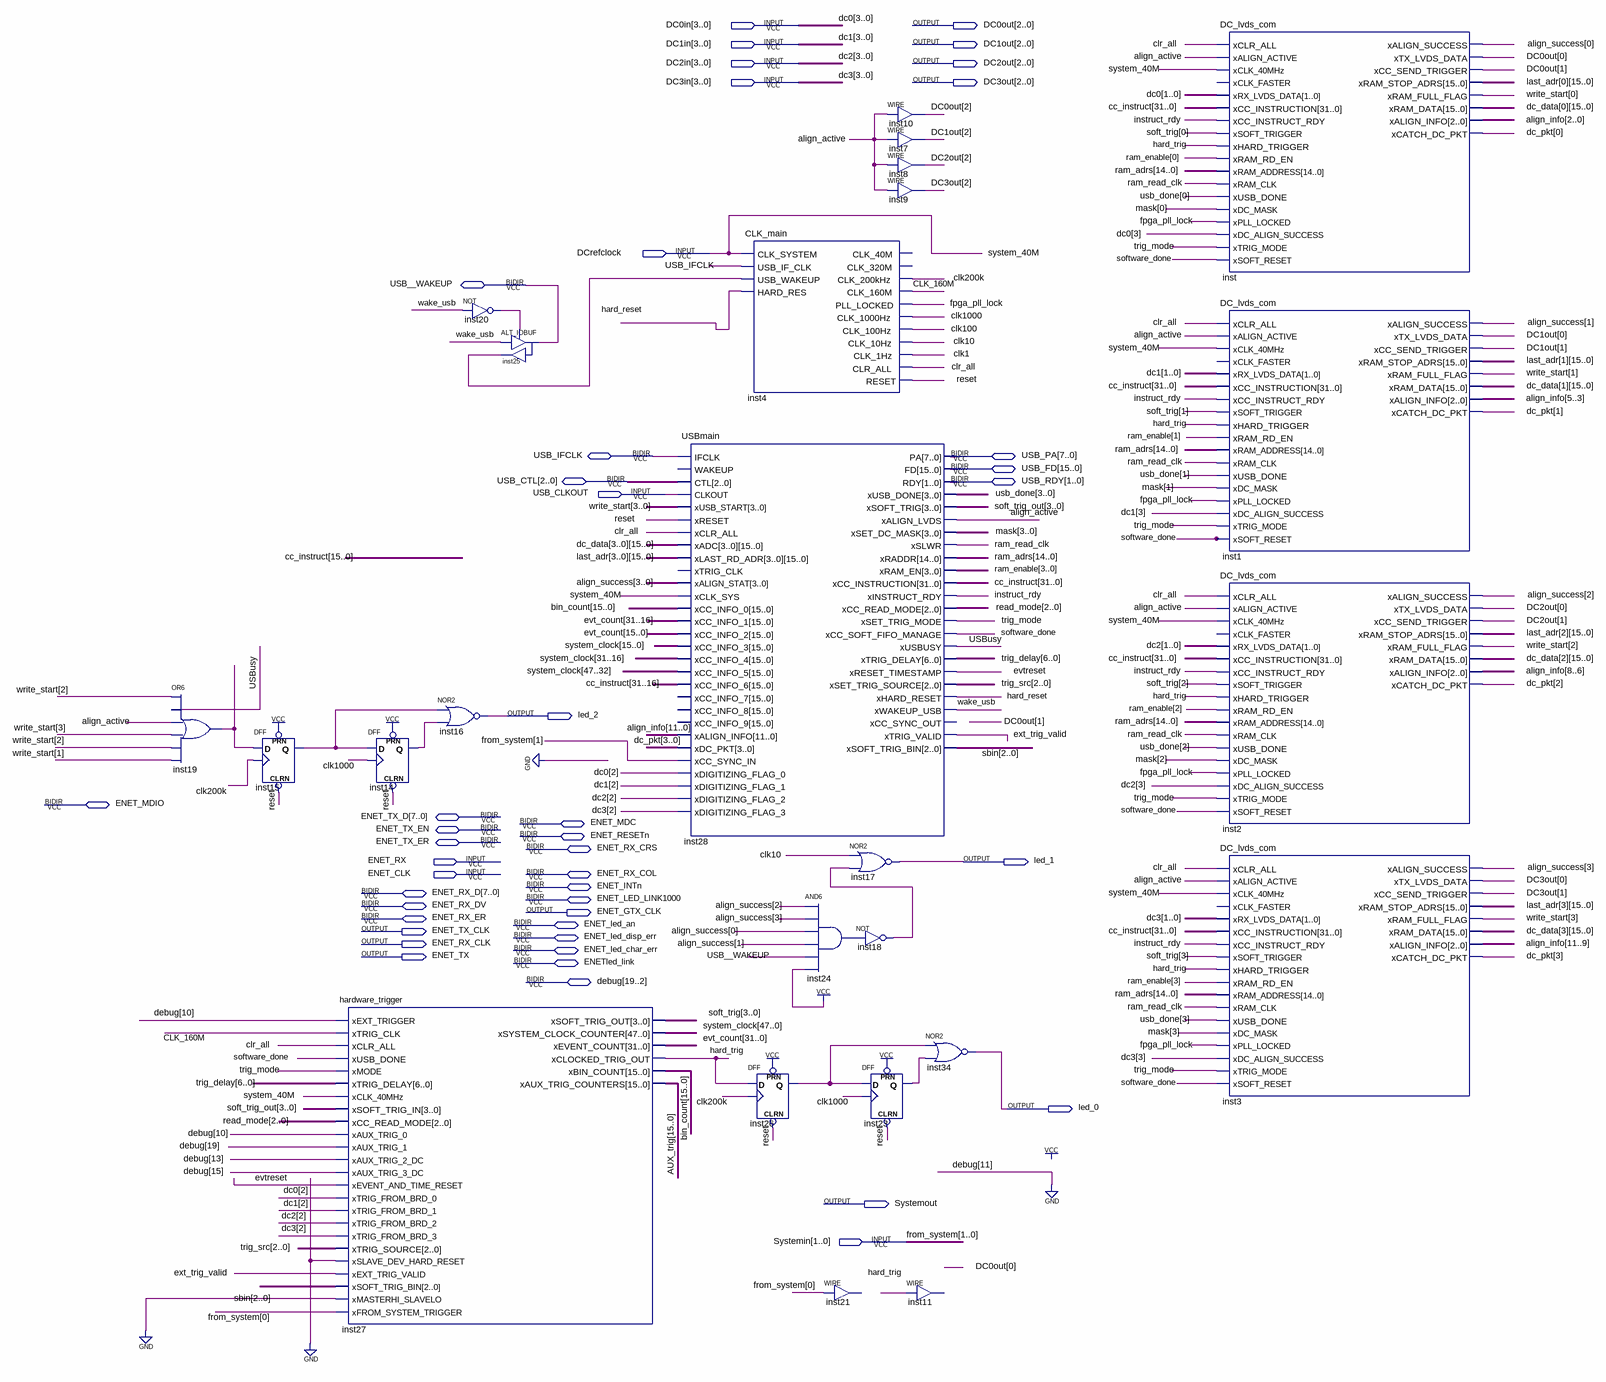
[diagram p0: schematic sheet]
// Quartus schematic Central_Card_Slave.bdf as structural Verilog: 25 symbols, 45 pins
module Central_Card_Slave (
  input  [3:0] DC0in,
  input  [3:0] DC1in,
  input  [3:0] DC2in,
  input  [3:0] DC3in,
  input  DCrefclock,
  input  USB_CLKOUT,
  input  ENET_RX,
  input  ENET_CLK,
  input  [1:0] Systemin,
  inout  USB__WAKEUP,
  inout  USB_IFCLK,
  inout  [7:0] USB_PA,
  inout  [15:0] USB_FD,
  inout  [2:0] USB_CTL,
  inout  [1:0] USB_RDY,
  inout  ENET_MDIO,
  inout  [7:0] ENET_TX_D,
  inout  ENET_MDC,
  inout  ENET_TX_EN,
  inout  ENET_RESETn,
  inout  ENET_TX_ER,
  inout  ENET_RX_CRS,
  inout  ENET_RX_COL,
  inout  ENET_INTn,
  inout  [7:0] ENET_RX_D,
  inout  ENET_LED_LINK1000,
  inout  ENET_RX_DV,
  inout  ENET_RX_ER,
  inout  ENET_led_an,
  inout  ENET_led_disp_err,
  inout  ENET_led_char_err,
  inout  ENETled_link,
  inout  [19:2] debug,
  output [2:0] DC0out,
  output [2:0] DC1out,
  output [2:0] DC2out,
  output [2:0] DC3out,
  output led_2,
  output led_1,
  output ENET_GTX_CLK,
  output ENET_TX_CLK,
  output ENET_RX_CLK,
  output ENET_TX,
  output led_0,
  output Systemout
);

  wire align_active, clk1, clk10, clk100, clk200k, clk1000, CLK_160M, clr_all, evtreset, ext_trig_valid,
       fpga_pll_lock, hard_reset, hard_trig, inst14_q, inst15_q, inst18_out, inst19_out, inst20_out,
       inst23_q, inst24_out, inst25_o, inst26_q, instruct_rdy, ram_read_clk, reset, software_done, trig_mode,
       USBusy, wake_usb;
  wire [2:0] read_mode, sbin, trig_src;
  wire [3:0] align_success, dc_pkt, mask, ram_enable, soft_trig, soft_trig_out, usb_done, write_start;
  wire [6:0] trig_delay;
  wire [11:0] align_info;
  wire [14:0] ram_adrs;
  wire [15:0] AUX_trig, bin_count, dc_data_0, dc_data_1, dc_data_2, dc_data_3, last_adr_0, last_adr_1,
       last_adr_2, last_adr_3;
  wire [31:0] cc_instruct, evt_count;
  wire [47:0] system_clock;

  or inst19 (inst19_out, write_start[2], USBusy, align_active, write_start[3], write_start[2], write_start[1]);
  DFF inst15 (.CLRN(reset), .CLK(clk200k), .D(inst19_out), .PRN(1'b1), .Q(inst15_q));
  hardware_trigger inst27 (
    .xEXT_TRIGGER(debug[10]), .xTRIG_CLK(CLK_160M), .xCLR_ALL(clr_all), .xUSB_DONE(software_done),
    .xMODE(trig_mode), .xTRIG_DELAY(trig_delay), .xCLK_40MHz(DCrefclock), .xSOFT_TRIG_IN(soft_trig_out),
    .xCC_READ_MODE(read_mode), .xAUX_TRIG_0(debug[10]), .xAUX_TRIG_1(debug[19]), .xAUX_TRIG_2_DC(debug[13]),
    .xAUX_TRIG_3_DC(debug[15]), .xEVENT_AND_TIME_RESET(evtreset), .xTRIG_FROM_BRD_0(DC0in[2]),
    .xTRIG_FROM_BRD_1(DC1in[2]), .xTRIG_FROM_BRD_2(DC2in[2]), .xTRIG_FROM_BRD_3(DC3in[2]),
    .xTRIG_SOURCE(trig_src), .xSLAVE_DEV_HARD_RESET(1'b0), .xEXT_TRIG_VALID(ext_trig_valid),
    .xSOFT_TRIG_BIN(sbin), .xMASTERHI_SLAVELO(1'b0), .xFROM_SYSTEM_TRIGGER(Systemin[0]),
    .xSOFT_TRIG_OUT(soft_trig), .xSYSTEM_CLOCK_COUNTER(system_clock), .xEVENT_COUNT(evt_count),
    .xCLOCKED_TRIG_OUT(hard_trig), .xBIN_COUNT(bin_count), .xAUX_TRIG_COUNTERS(AUX_trig));
  DFF inst14 (.CLRN(reset), .CLK(clk1000), .D(inst15_q), .PRN(1'b1), .Q(inst14_q));
  nor inst16 (led_2, inst15_q, inst14_q);
  not inst20 (inst20_out, wake_usb);
  ALT_IOBUF inst25 (.i(wake_usb), .oe(inst20_out), .o(inst25_o), .io(USB__WAKEUP));
  USBmain inst28 (
    .IFCLK(USB_IFCLK), .CTL(USB_CTL), .CLKOUT(USB_CLKOUT), .xUSB_START(write_start), .xRESET(reset),
    .xCLR_ALL(clr_all), .xADC({dc_data_3, dc_data_2, dc_data_1, dc_data_0}),
    .xLAST_RD_ADR({last_adr_3, last_adr_2, last_adr_1, last_adr_0}), .xALIGN_STAT(align_success),
    .xCLK_SYS(DCrefclock), .xCC_INFO_0(bin_count), .xCC_INFO_1(evt_count[31:16]),
    .xCC_INFO_2(evt_count[15:0]), .xCC_INFO_3(system_clock[15:0]), .xCC_INFO_4(system_clock[31:16]),
    .xCC_INFO_5(system_clock[47:32]), .xCC_INFO_6(cc_instruct[31:16]), .xALIGN_INFO(align_info),
    .xDC_PKT(dc_pkt), .xCC_SYNC_IN(Systemin[1]), .xDIGITIZING_FLAG_0(DC0in[2]),
    .xDIGITIZING_FLAG_1(DC1in[2]), .xDIGITIZING_FLAG_2(DC2in[2]), .xDIGITIZING_FLAG_3(DC3in[2]),
    .RDY(USB_RDY), .xUSB_DONE(usb_done), .xSOFT_TRIG(soft_trig_out), .xALIGN_LVDS(align_active),
    .xSET_DC_MASK(mask), .xSLWR(ram_read_clk), .xRADDR(ram_adrs), .xRAM_EN(ram_enable),
    .xCC_INSTRUCTION(cc_instruct), .xINSTRUCT_RDY(instruct_rdy), .xCC_READ_MODE(read_mode),
    .xSET_TRIG_MODE(trig_mode), .xCC_SOFT_FIFO_MANAGE(software_done), .xUSBUSY(USBusy),
    .xTRIG_DELAY(trig_delay), .xRESET_TIMESTAMP(evtreset), .xSET_TRIG_SOURCE(trig_src),
    .xHARD_RESET(hard_reset), .xWAKEUP_USB(wake_usb), .xTRIG_VALID(ext_trig_valid), .xSOFT_TRIG_BIN(sbin),
    .PA(USB_PA), .FD(USB_FD));  // open: WAKEUP, xTRIG_CLK, xCC_INFO_7, xCC_INFO_8, xCC_INFO_9, xCC_SYNC_OUT
  CLK_main inst4 (
    .CLK_SYSTEM(DCrefclock), .USB_IF_CLK(USB_IFCLK), .USB_WAKEUP(inst25_o), .HARD_RES(hard_reset),
    .CLK_200kHz(clk200k), .CLK_160M(CLK_160M), .PLL_LOCKED(fpga_pll_lock), .CLK_1000Hz(clk1000),
    .CLK_100Hz(clk100), .CLK_10Hz(clk10), .CLK_1Hz(clk1), .CLR_ALL(clr_all), .RESET(reset));  // open: CLK_40M, CLK_320M
  DFF inst26 (.CLRN(reset), .CLK(clk200k), .D(hard_trig), .PRN(1'b1), .Q(inst26_q));
  and inst24 (inst24_out, align_success[2], align_success[3], align_success[0], align_success[1], USB__WAKEUP, 1'b1);
  nor inst17 (led_1, clk10, inst18_out);
  not inst18 (inst18_out, inst24_out);
  DFF inst23 (.CLRN(reset), .CLK(clk1000), .D(inst26_q), .PRN(1'b1), .Q(inst23_q));
  // WIRE inst21 has open pins
  assign DC0out[2] = align_active;  // WIRE inst10
  assign DC1out[2] = align_active;  // WIRE inst7
  assign DC2out[2] = align_active;  // WIRE inst8
  assign DC3out[2] = align_active;  // WIRE inst9
  // WIRE inst11 has open pins
  nor inst34 (led_0, inst26_q, inst23_q);
  DC_lvds_com inst (
    .xCLR_ALL(clr_all), .xALIGN_ACTIVE(align_active), .xCLK_40MHz(DCrefclock), .xRX_LVDS_DATA(DC0in[1:0]),
    .xCC_INSTRUCTION(cc_instruct), .xCC_INSTRUCT_RDY(instruct_rdy), .xSOFT_TRIGGER(soft_trig[0]),
    .xHARD_TRIGGER(hard_trig), .xRAM_RD_EN(ram_enable[0]), .xRAM_ADDRESS(ram_adrs), .xRAM_CLK(ram_read_clk),
    .xUSB_DONE(usb_done[0]), .xDC_MASK(mask[0]), .xPLL_LOCKED(fpga_pll_lock), .xDC_ALIGN_SUCCESS(DC0in[3]),
    .xTRIG_MODE(trig_mode), .xSOFT_RESET(software_done), .xALIGN_SUCCESS(align_success[0]),
    .xTX_LVDS_DATA(DC0out[0]), .xCC_SEND_TRIGGER(DC0out[1]), .xRAM_STOP_ADRS(last_adr_0),
    .xRAM_FULL_FLAG(write_start[0]), .xRAM_DATA(dc_data_0), .xALIGN_INFO(align_info[2:0]),
    .xCATCH_DC_PKT(dc_pkt[0]));  // open: xCLK_FASTER
  DC_lvds_com inst1 (
    .xCLR_ALL(clr_all), .xALIGN_ACTIVE(align_active), .xCLK_40MHz(DCrefclock), .xRX_LVDS_DATA(DC1in[1:0]),
    .xCC_INSTRUCTION(cc_instruct), .xCC_INSTRUCT_RDY(instruct_rdy), .xSOFT_TRIGGER(soft_trig[1]),
    .xHARD_TRIGGER(hard_trig), .xRAM_RD_EN(ram_enable[1]), .xRAM_ADDRESS(ram_adrs), .xRAM_CLK(ram_read_clk),
    .xUSB_DONE(usb_done[1]), .xDC_MASK(mask[1]), .xPLL_LOCKED(fpga_pll_lock), .xDC_ALIGN_SUCCESS(DC1in[3]),
    .xTRIG_MODE(trig_mode), .xSOFT_RESET(software_done), .xALIGN_SUCCESS(align_success[1]),
    .xTX_LVDS_DATA(DC1out[0]), .xCC_SEND_TRIGGER(DC1out[1]), .xRAM_STOP_ADRS(last_adr_1),
    .xRAM_FULL_FLAG(write_start[1]), .xRAM_DATA(dc_data_1), .xALIGN_INFO(align_info[5:3]),
    .xCATCH_DC_PKT(dc_pkt[1]));  // open: xCLK_FASTER
  DC_lvds_com inst2 (
    .xCLR_ALL(clr_all), .xALIGN_ACTIVE(align_active), .xCLK_40MHz(DCrefclock), .xRX_LVDS_DATA(DC2in[1:0]),
    .xCC_INSTRUCTION(cc_instruct), .xCC_INSTRUCT_RDY(instruct_rdy), .xSOFT_TRIGGER(soft_trig[2]),
    .xHARD_TRIGGER(hard_trig), .xRAM_RD_EN(ram_enable[2]), .xRAM_ADDRESS(ram_adrs), .xRAM_CLK(ram_read_clk),
    .xUSB_DONE(usb_done[2]), .xDC_MASK(mask[2]), .xPLL_LOCKED(fpga_pll_lock), .xDC_ALIGN_SUCCESS(DC2in[3]),
    .xTRIG_MODE(trig_mode), .xSOFT_RESET(software_done), .xALIGN_SUCCESS(align_success[2]),
    .xTX_LVDS_DATA(DC2out[0]), .xCC_SEND_TRIGGER(DC2out[1]), .xRAM_STOP_ADRS(last_adr_2),
    .xRAM_FULL_FLAG(write_start[2]), .xRAM_DATA(dc_data_2), .xALIGN_INFO(align_info[8:6]),
    .xCATCH_DC_PKT(dc_pkt[2]));  // open: xCLK_FASTER
  DC_lvds_com inst3 (
    .xCLR_ALL(clr_all), .xALIGN_ACTIVE(align_active), .xCLK_40MHz(DCrefclock), .xRX_LVDS_DATA(DC3in[1:0]),
    .xCC_INSTRUCTION(cc_instruct), .xCC_INSTRUCT_RDY(instruct_rdy), .xSOFT_TRIGGER(soft_trig[3]),
    .xHARD_TRIGGER(hard_trig), .xRAM_RD_EN(ram_enable[3]), .xRAM_ADDRESS(ram_adrs), .xRAM_CLK(ram_read_clk),
    .xUSB_DONE(usb_done[3]), .xDC_MASK(mask[3]), .xPLL_LOCKED(fpga_pll_lock), .xDC_ALIGN_SUCCESS(DC3in[3]),
    .xTRIG_MODE(trig_mode), .xSOFT_RESET(software_done), .xALIGN_SUCCESS(align_success[3]),
    .xTX_LVDS_DATA(DC3out[0]), .xCC_SEND_TRIGGER(DC3out[1]), .xRAM_STOP_ADRS(last_adr_3),
    .xRAM_FULL_FLAG(write_start[3]), .xRAM_DATA(dc_data_3), .xALIGN_INFO(align_info[11:9]),
    .xCATCH_DC_PKT(dc_pkt[3]));  // open: xCLK_FASTER
  // also tied to GND on the sheet: debug[11]

  // Other names for the same wires on the sheet: dc0[3:0] = DC0in; dc1[3:0] = DC1in; dc2[3:0] = DC2in;
  //   dc3[3:0] = DC3in; system_40M = DCrefclock; from_system[1:0] = Systemin
endmodule
